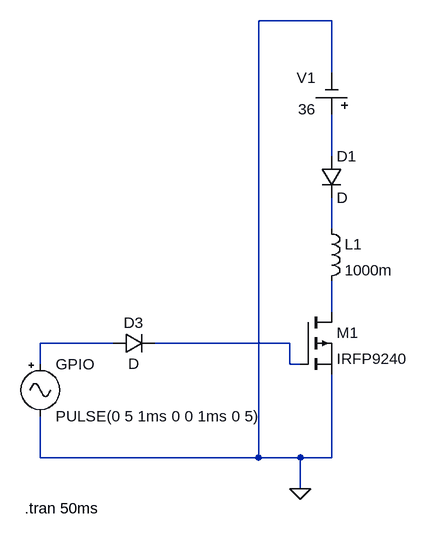
[diagram p0: schematic Draft3.asc]
Draft3.asc, the LTspice schematic file:
Version 4
SHEET 1 880 680
WIRE 256 -336 144 -336
WIRE 256 -256 256 -336
WIRE 256 -128 256 -192
WIRE 256 -16 256 -64
WIRE 256 112 256 64
WIRE -80 160 -192 160
WIRE 192 160 -16 160
WIRE -192 192 -192 160
WIRE 192 192 192 160
WIRE 208 192 192 192
WIRE -192 336 -192 272
WIRE 144 336 144 -336
WIRE 144 336 -192 336
WIRE 208 336 144 336
WIRE 256 336 256 208
WIRE 256 336 208 336
WIRE 208 384 208 336
FLAG 208 384 0
SYMBOL pmos 208 112 R0
SYMATTR InstName M1
SYMATTR Value IRFP9240
SYMBOL ind 240 -32 R0
SYMATTR InstName L1
SYMATTR Value 1000m
SYMBOL diode 240 -128 R0
SYMATTR InstName D1
SYMBOL Misc\\cell 256 -192 R180
WINDOW 0 24 56 Left 2
WINDOW 3 24 8 Left 2
WINDOW 123 0 0 Left 0
WINDOW 39 0 0 Left 0
SYMATTR InstName V1
SYMATTR Value 36
SYMBOL Misc\\signal -192 176 R0
WINDOW 123 0 0 Left 0
WINDOW 39 0 0 Left 0
SYMATTR InstName GPIO
SYMATTR Value PULSE(0 5 1ms 0 0 1ms 0 5)
SYMBOL diode -80 176 R270
WINDOW 0 32 32 VTop 2
WINDOW 3 0 32 VBottom 2
SYMATTR InstName D3
TEXT -216 414 Left 2 !.tran 50ms

The netlist it stands for:
* Draft3.asc
M1 N003 N005 0 0 IRFP9240
L1 N002 N003 1000m
D1 N001 N002 D
V1 N001 0 36
V§GPIO N004 0 PULSE(0 5 1ms 0 0 1ms 0 5)
D3 N004 N005 D
.model D D
.lib standard.dio
.model NMOS NMOS
.model PMOS PMOS
.lib standard.mos
.tran 50ms
.backanno
.end